# EAGLE design shield (EAGLE 7.2.0)
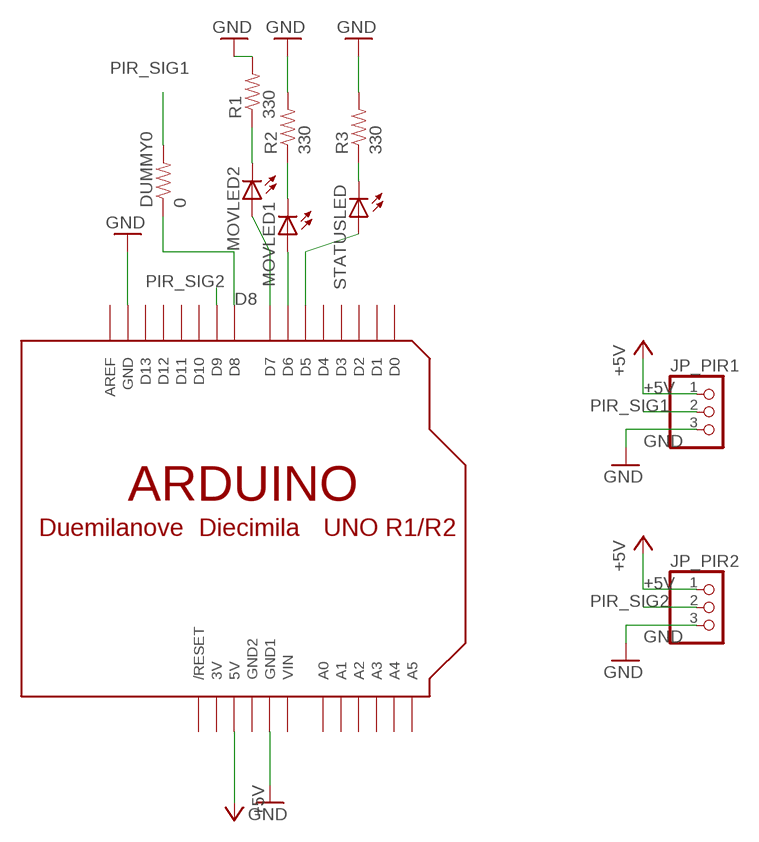
[diagram p0: schematic, sheet 1]

## Parts
DUMMY0  0  RESISTORPTH-1/4W  [AXIAL-0.4]
JP_PIR1  PINHD-1X3  [1X03]
JP_PIR2  PINHD-1X3  [1X03]
MOVLED1  LED5MM  [LED5MM]
MOVLED2  LED5MM  [LED5MM]
R1  330  RESISTORPTH-1/4W  [AXIAL-0.4]
R2  330  RESISTORPTH-1/4W  [AXIAL-0.4]
R3  330  RESISTORPTH-1/4W  [AXIAL-0.4]
STATUSLED  LED5MM  [LED5MM]
U$1  ARDUINOUNO  [ARDUINO]

## Nets
+5V: JP_PIR1.1 JP_PIR2.1 U$1.5V
D8: DUMMY0.P$1 U$1.D8
GND: JP_PIR1.3 JP_PIR2.3 R1.P$2 R2.P$2 R3.P$2 U$1.GND U$1.GND1
N$1: R3.P$1 STATUSLED.K(C)
N$2: MOVLED2.K(C) R1.P$1
N$3: MOVLED1.K(C) R2.P$1
N$4: STATUSLED.A U$1.D5
N$5: MOVLED1.A U$1.D6
N$6: MOVLED2.A U$1.D7
PIR_SIG1: DUMMY0.P$2 JP_PIR1.2
PIR_SIG2: JP_PIR2.2 U$1.D9
Unconnected: U$1.A0 U$1.A1 U$1.A2 U$1.A3 U$1.A4 U$1.A5 U$1.AREF U$1.D0 U$1.D1 U$1.D2 U$1.D3 U$1.D4 U$1.D10 U$1.D11 U$1.D12 U$1.D13 U$1.RESET(/RESET)

## Power pins joined to a net without a drawn wire
3V: U$1.3V
GND2: U$1.GND2
VIN: U$1.VIN

## Library data of the parts
DUMMY0 R1-R3 = SparkFun-Resistors:RESISTOR: Resistor Basic schematic elements and footprints for 0603, 1206, and PTH resistors.
JP_PIR1 JP_PIR2 = adafruit:PINHD-1X3: PIN HEADER
MOVLED1 MOVLED2 STATUSLED = led:LED: LED OSRAM: - CHIPLED LG R971, LG N971, LY N971, LG Q971, LY Q971, LO R971, LY R971 LH N974, LH R974 LS Q976, LO Q976, LY Q976 LO Q996 - Hyper CHIPLED LW Q18S LB Q993, LB Q99A, LB R99A - SideLED LS A670, LO A670, LY A670, LG A670, LP A670 LB A673, LV A673, LT A673, LW A673 LH A674 LY A675 LS A676, LA A676, LO A676, LY A676, LW A676 LS A679, LY A679, LG A679 - Hyper Micro SIDELED® LS Y876, LA Y876, LO Y876, LY Y876 LT Y87S - SmartLED LW L88C, LW L88S LB L89C, LB L89S, LG L890 LS L89K, LO L89K, LY L89K LS L896, LA L896, LO L896, LY L896 - TOPLED LS T670, LO T670, LY T670, LG T670, LP T670 LSG T670, LSP T670, LSY T670, LOP T670, LYG T670 LG T671, LOG T671, LSG T671 LB T673, LV T673, LT T673, LW T673 LH T674 LS T676, LA T676, LO T676, LY T676, LB T676, LH T676, LSB T676, LW T676 LB T67C, LV T67C, LT T67C, LS T67K, LO T67K, LY T67K, LW E67C LS E67B, LA E67B, LO E67B, LY E67B, LB E67C, LV E67C, LT E67C LW T67C LS T679, LY T679, LG T679 LS T770, LO T770, LY T770, LG T770, LP T770 LB T773, LV T773, LT T773, LW T773 LH T774 LS E675, LA E675, LY E675, LS T675 LS T776, LA T776, LO T776, LY T776, LB T776 LHGB T686 LT T68C, LB T68C - Hyper Mini TOPLED® LB M676 - Mini TOPLED Santana® LG M470 LS M47K, LO M47K, LY M47K Source: http://www.osram.convergy.de LUXEON: - LUMILED® LXK2-PW12-R00, LXK2-PW12-S00, LXK2-PW14-U00, LXK2-PW14-V00 LXK2-PM12-R00, LXK2-PM12-S00, LXK2-PM14-U00 LXK2-PE12-Q00, LXK2-PE12-R00, LXK2-PE12-S00, LXK2-PE14-T00, LXK2-PE14-U00 LXK2-PB12-K00, LXK2-PB12-L00, LXK2-PB12-M00, LXK2-PB14-N00, LXK2-PB14-P00, LXK2-PB14-Q00 LXK2-PR12-L00, LXK2-PR12-M00, LXK2-PR14-Q00, LXK2-PR14-R00 LXK2-PD12-Q00, LXK2-PD12-R00, LXK2-PD12-S00 LXK2-PH12-R00, LXK2-PH12-S00 LXK2-PL12-P00, LXK2-PL12-Q00, LXK2-PL12-R00 Source: www.luxeon.com KINGBRIGHT: KA-3528ASYC Source: www.kingbright.com
U$1 = adafruit:ARDUINO: Arduino Diecimila/Duemilanove Make a shield with ease, this package has all the named pins as well as the two mounting drill holes and an outline of the USB and DC power connector. The outline is on the DIMENSION layer, so if your board house uses it they will cut the outline to match. http://www.ladyada.net/library/pcb/eaglelibrary.html

## Board
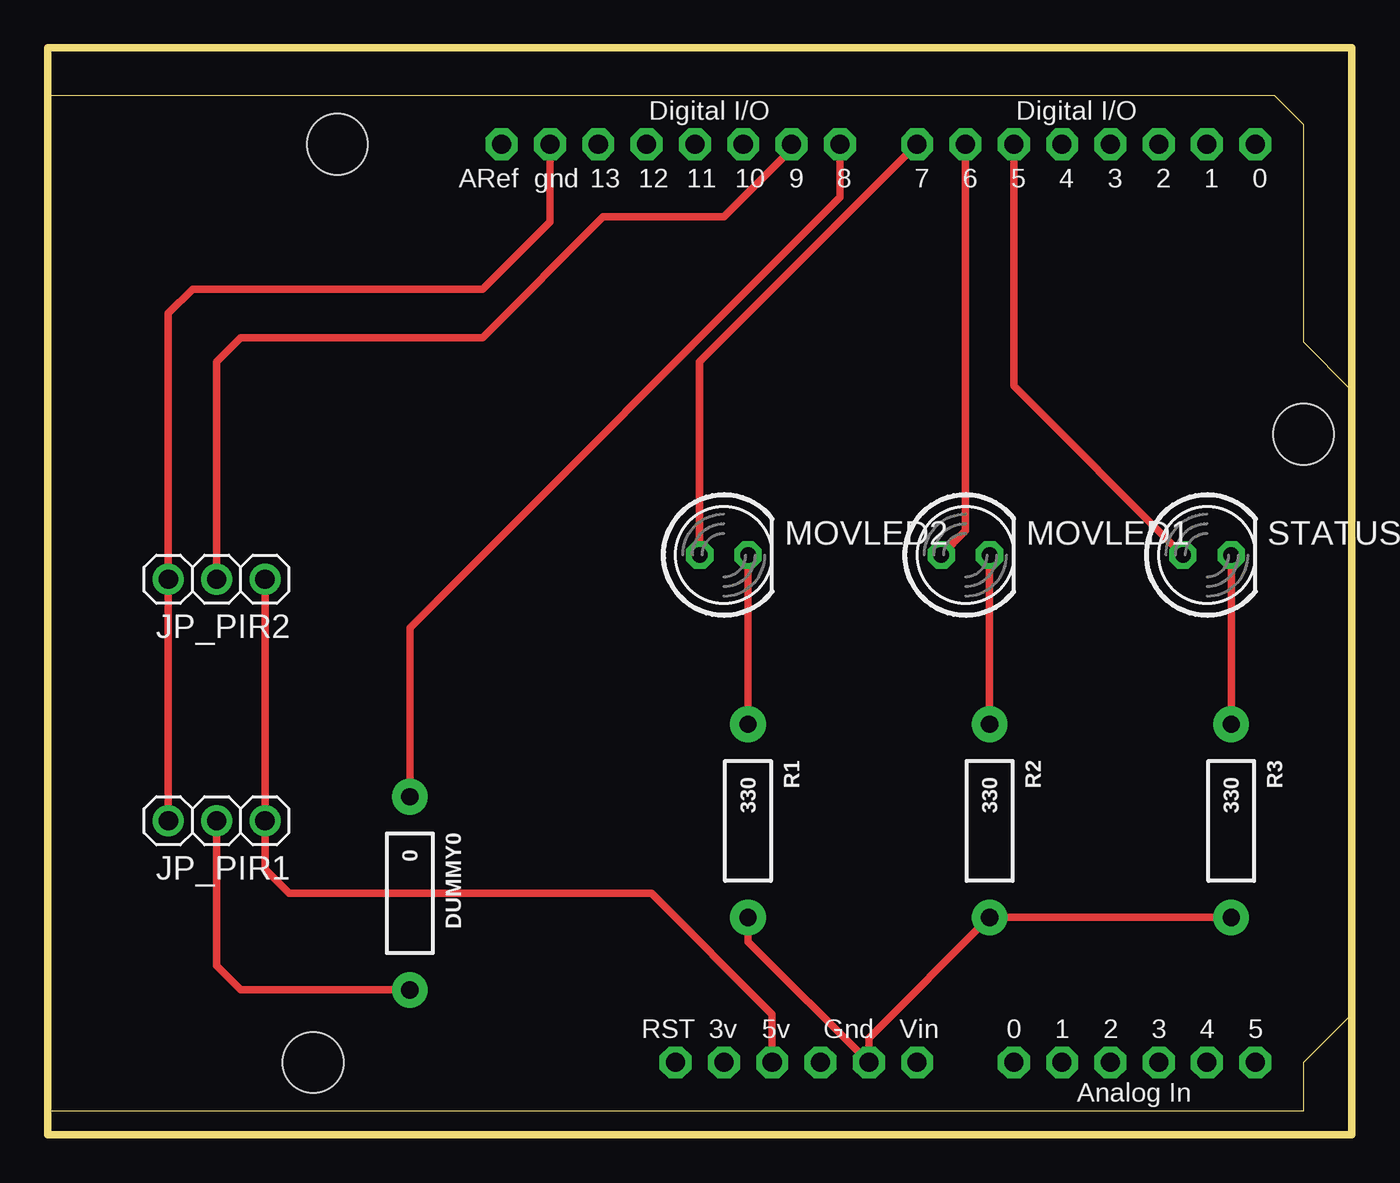
[diagram p1: board, top side]
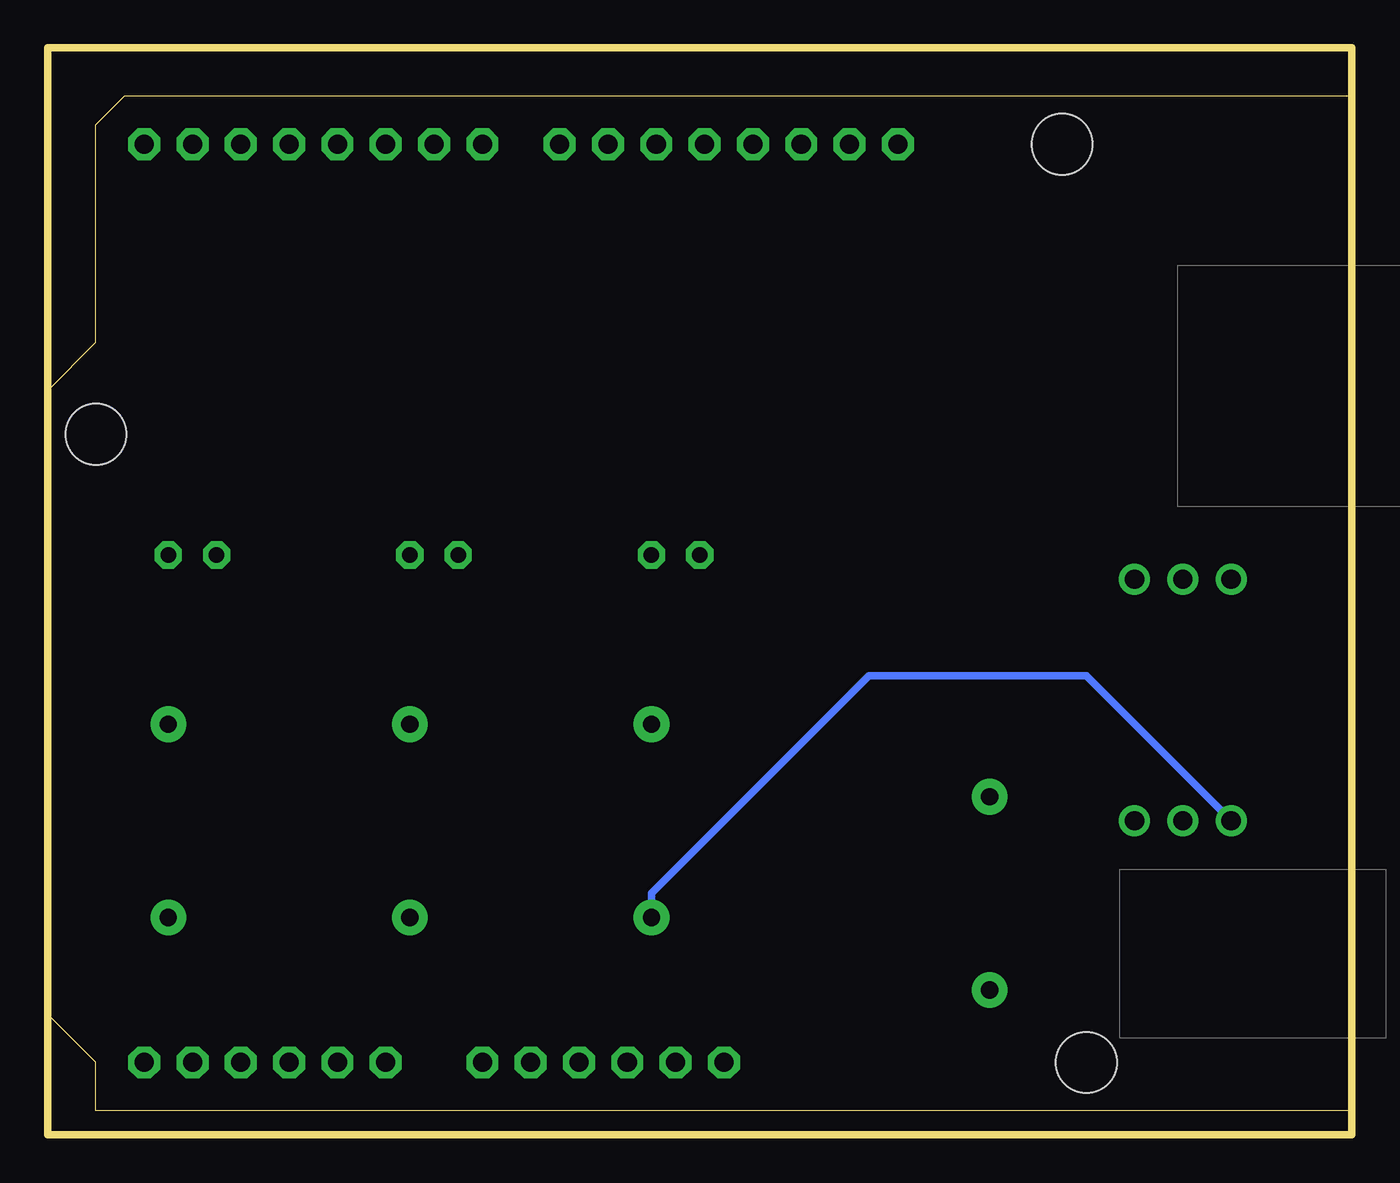
[diagram p2: board, bottom side, seen from below]

Size 68.58 x 57.15 mm. Coordinates in mm from the lower left corner, seen from the top.
Outline: 68.58,57.15 68.58,0 0,0 0,57.15 68.58,57.15
Copper layers (1*16): Top 0.035mm / dielectric 1.5mm / Bottom 0.035mm
Design rules "SparkFun": minimum track width 8mil, minimum drill 20mil, track to track 8mil, track to pad 8mil, pad to pad 8mil, via to via 8mil, smd to smd 8mil, copper to edge 8mil, drill to drill 8mil, minimum pad ring 12mil, minimum via ring 10mil, stop-mask expansion 4mil, vias tented up to drill 20mil, thermal gap 10mil

### Footprints (pad centres in the part's own frame; a part is rotated, then mirrored left to right if it is on the bottom)
AXIAL-0.4 = drill 0.9 pad 1.88: P$1 -5.08,0; P$2 5.08,0
1X03 = drill 1.016: 1 -2.54,0; 2 0,0; 3 2.54,0
LED5MM = drill 0.813 octagon: A -1.27,0; K 1.27,0
ARDUINO = drill 1 pad 1.676 octagon: 3V 35.56,2.54; 5V 38.1,2.54; A0 50.8,2.54; A1 53.34,2.54; A2 55.88,2.54; A3 58.42,2.54; A4 60.96,2.54; A5 63.5,2.54; AREF 23.876,50.8; D0 63.5,50.8; D1 60.96,50.8; D2 58.42,50.8; D3 55.88,50.8; D4 53.34,50.8; D5 50.8,50.8; D6 48.26,50.8; D7 45.72,50.8; D8 41.656,50.8; D9 39.116,50.8; D10 36.576,50.8; D11 34.036,50.8; D12 31.496,50.8; D13 28.956,50.8; GND 26.416,50.8; GND1 43.18,2.54; GND2 40.64,2.54; RESET 33.02,2.54; VIN 45.72,2.54 | hole 3.2: 15.24,50.8; 66.04,35.56; 13.97,2.54

### Placement (x,y rotation side)
DUMMY0  19.05,12.7 270 top
JP_PIR1  8.89,16.51 180 top
JP_PIR2  8.89,29.21 180 top
MOVLED1  48.26,30.48 0 top
MOVLED2  35.56,30.48 0 top
R1  36.83,16.51 270 top
R2  49.53,16.51 270 top
R3  62.23,16.51 270 top
STATUSLED  60.96,30.48 0 top
U$1  0,1.27 0 top

### Tracks (layer width: path | path; a pad name or v marks a point on that pad's centre or on a via)
+5V
  Top 0.406: U$1.5V 38.1,6.35 31.75,12.7 12.7,12.7 11.43,13.97 JP_PIR1.1 JP_PIR2.1
D8
  Top 0.406: U$1.D8 41.66,49.28 19.05,26.67 DUMMY0.P$1
GND
  Top 0.406: R3.P$2 R2.P$2 43.18,5.08 U$1.GND1 36.83,10.16 R1.P$2 | JP_PIR1.3 JP_PIR2.3 6.35,43.18 7.62,44.45 22.86,44.45 26.42,48.01 U$1.GND
  Bottom 0.406: JP_PIR1.3 13.97,24.13 25.4,24.13 36.83,12.7 R1.P$2
N$1
  Top 0.406: STATUSLED.K R3.P$1
N$2
  Top 0.406: MOVLED2.K R1.P$1
N$3
  Top 0.406: MOVLED1.K R2.P$1
N$4
  Top 0.406: U$1.D5 50.8,39.37 STATUSLED.A
N$5
  Top 0.406: U$1.D6 48.26,31.75 MOVLED1.A
N$6
  Top 0.406: MOVLED2.A 34.29,40.64 U$1.D7
PIR_SIG1
  Top 0.406: DUMMY0.P$2 10.16,7.62 8.89,8.89 JP_PIR1.2
PIR_SIG2
  Top 0.406: U$1.D9 39.12,51.82 35.56,48.26 29.21,48.26 22.86,41.91 10.16,41.91 8.89,40.64 JP_PIR2.2